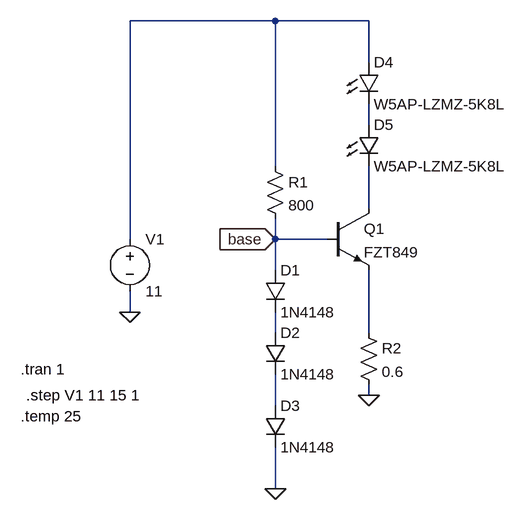
[diagram p0: schematic bjt_current_source.asc]
bjt_current_source.asc, the LTspice schematic file:
Version 4
SHEET 1 880 680
WIRE 176 -192 -48 -192
WIRE 320 -192 176 -192
WIRE 320 -128 320 -192
WIRE 320 -32 320 -64
WIRE 176 32 176 -192
WIRE 320 96 320 32
WIRE -48 144 -48 -192
WIRE 176 144 176 112
WIRE 256 144 176 144
WIRE 176 192 176 144
WIRE -48 256 -48 224
WIRE 176 288 176 256
WIRE 320 288 320 192
WIRE 320 384 320 368
WIRE 176 400 176 352
WIRE 176 528 176 464
FLAG -48 256 0
FLAG 176 528 0
FLAG 320 384 0
FLAG 176 144 base
IOPIN 176 144 In
SYMBOL voltage -48 128 R0
WINDOW 123 0 0 Left 2
WINDOW 39 0 0 Left 2
SYMATTR InstName V1
SYMATTR Value 11
SYMBOL npn 256 96 R0
SYMATTR InstName Q1
SYMATTR Value FZT849
SYMBOL diode 160 192 R0
SYMATTR InstName D1
SYMATTR Value 1N4148
SYMBOL res 160 16 R0
SYMATTR InstName R1
SYMATTR Value 800
SYMBOL res 304 272 R0
SYMATTR InstName R2
SYMATTR Value 0.6
SYMBOL diode 160 288 R0
SYMATTR InstName D2
SYMATTR Value 1N4148
SYMBOL LED 304 -128 R0
SYMATTR InstName D4
SYMATTR Value W5AP-LZMZ-5K8L
SYMATTR Description Diode
SYMATTR Type diode
SYMBOL LED 304 -32 R0
SYMATTR InstName D5
SYMATTR Value W5AP-LZMZ-5K8L
SYMATTR Description Diode
SYMATTR Type diode
SYMBOL diode 160 400 R0
SYMATTR InstName D3
SYMATTR Value 1N4148
TEXT -216 344 Left 2 !.tran 1
TEXT -216 416 Left 2 !.temp 25
TEXT -208 384 Left 2 !.step V1 11 15 1

The netlist it stands for:
* bjt_current_source.asc
V1 N001 0 11
Q1 N003 base N005 0 FZT849
D1 base N004 1N4148
R1 N001 base 800
R2 N005 0 0.6
D2 N004 N006 1N4148
D4 N001 N002 W5AP-LZMZ-5K8L
D5 N002 N003 W5AP-LZMZ-5K8L
D3 N006 0 1N4148
.model D D
.lib standard.dio
.model NPN NPN
.model PNP PNP
.lib standard.bjt
.tran 1
.temp 25
.step V1 11 15 1
.backanno
.end